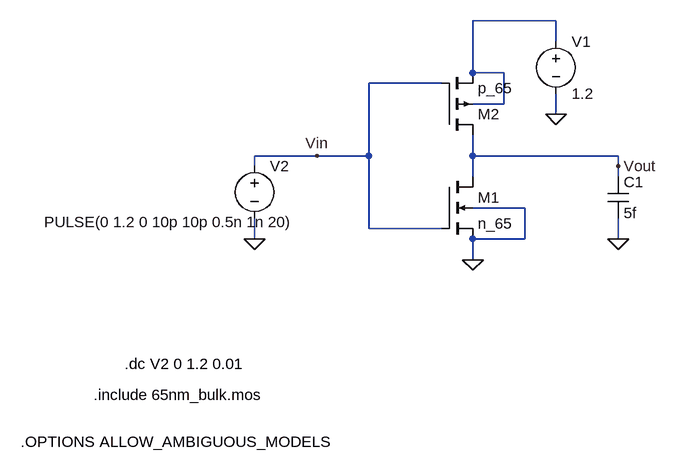
[diagram p0: schematic inverter.asc]
inverter.asc, the LTspice schematic file:
Version 4.1
SHEET 1 1592 680
WIRE 512 -176 384 -176
WIRE 512 -144 512 -176
WIRE 384 -96 384 -176
WIRE 432 -96 384 -96
WIRE 336 -80 224 -80
WIRE 432 -48 432 -96
WIRE 432 -48 384 -48
WIRE 512 -32 512 -64
WIRE 144 32 48 32
WIRE 224 32 224 -80
WIRE 224 32 144 32
WIRE 384 32 384 0
WIRE 608 32 384 32
WIRE 48 48 48 32
WIRE 608 48 608 32
WIRE 384 64 384 32
WIRE 608 64 608 48
WIRE 464 112 384 112
WIRE 224 144 224 32
WIRE 336 144 224 144
WIRE 48 160 48 128
WIRE 464 160 464 112
WIRE 464 160 384 160
WIRE 608 160 608 128
WIRE 384 192 384 160
FLAG 384 192 0
FLAG 512 -32 0
FLAG 608 48 Vout
FLAG 48 160 0
FLAG 608 160 0
FLAG 144 32 Vin
SYMBOL nmos4 336 64 R0
SYMATTR InstName M1
SYMATTR Value n_65
SYMATTR Value2 l=65n w=1u
SYMBOL pmos4 336 0 M180
SYMATTR InstName M2
SYMATTR Value p_65
SYMATTR Value2 l=65n w=1u
SYMBOL voltage 512 -160 R0
WINDOW 123 0 0 Left 0
WINDOW 39 0 0 Left 0
SYMATTR InstName V1
SYMATTR Value 1.2
SYMBOL voltage 48 32 R0
WINDOW 3 61 102 Right 2
WINDOW 123 0 0 Left 0
WINDOW 39 0 0 Left 0
SYMATTR Value PULSE(0 1.2 0 10p 10p 0.5n 1n 20)
SYMATTR InstName V2
SYMBOL cap 592 64 R0
SYMATTR InstName C1
SYMATTR Value 5f
TEXT -200 400 Left 2 !.include 65nm_bulk.mos
TEXT -312 472 Left 2 !.OPTIONS ALLOW_AMBIGUOUS_MODELS
TEXT -152 352 Left 2 !.dc V2 0 1.2 0.01

The netlist it stands for:
* inverter.asc
M1 Vout Vin 0 0 n_65 l=65n w=1u
M2 Vout Vin N001 N001 p_65 l=65n w=1u
V1 N001 0 1.2
V2 Vin 0 PULSE(0 1.2 0 10p 10p 0.5n 1n 20)
C1 Vout 0 5f
.model NMOS NMOS
.model PMOS PMOS
.lib standard.mos
.include 65nm_bulk.mos
.OPTIONS ALLOW_AMBIGUOUS_MODELS
.dc V2 0 1.2 0.01
.backanno
.end

* Results of the author's LTspice run, read from the files saved beside the schematic
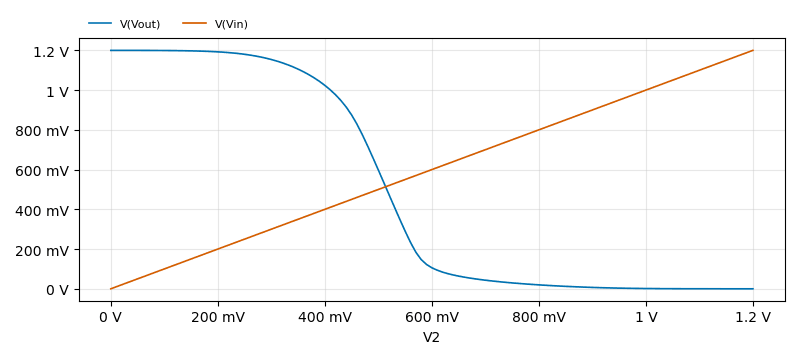
[diagram p1: DC transfer characteristic of inverter.asc, plotted from the saved traces]
* DC transfer characteristic, 1 run:
*   V(Vout): 1.2 V at V2=0 V, 20.17 µV at V2=1.2 V, min 20.17 µV, max 1.2 V
*   V(Vin): 0 V at V2=0 V, 1.2 V at V2=1.2 V, min 0 V, max 1.2 V